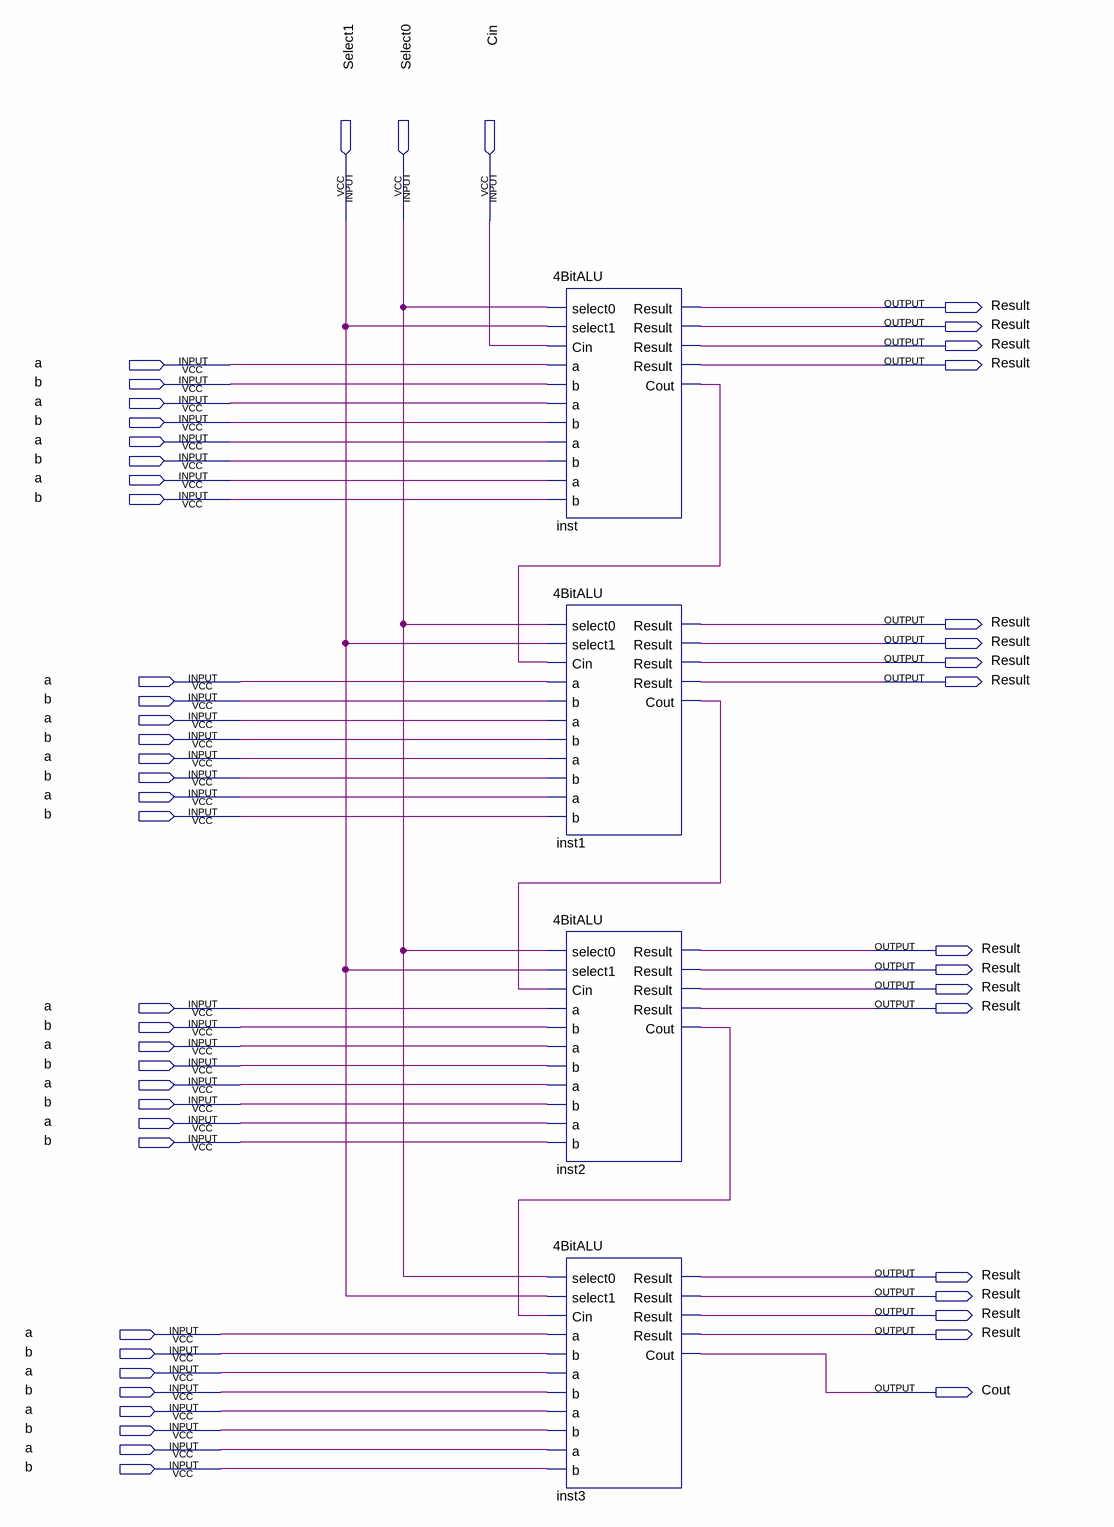
[diagram p0: schematic sheet]
// Quartus schematic 16BitALU.bdf as structural Verilog: 4 symbols, 52 pins
module \16BitALU  (
  input  Select1,
  input  Select0,
  input  Cin,
  input  a,
  input  b,
  output Result,
  output Cout
);

  wire inst1_cout, inst2_cout, inst_cout;

  \4BitALU  inst (
    .select0(Select0), .select1(Select1), .Cin(Cin), .a({4{a}}), .b({4{b}}), .Result({4{Result}}),
    .Cout(inst_cout));
  \4BitALU  inst1 (
    .select0(Select0), .select1(Select1), .Cin(inst_cout), .a({4{a}}), .b({4{b}}), .Result({4{Result}}),
    .Cout(inst1_cout));
  \4BitALU  inst2 (
    .select0(Select0), .select1(Select1), .Cin(inst1_cout), .a({4{a}}), .b({4{b}}), .Result({4{Result}}),
    .Cout(inst2_cout));
  \4BitALU  inst3 (
    .select0(Select0), .select1(Select1), .Cin(inst2_cout), .a({4{a}}), .b({4{b}}), .Result({4{Result}}),
    .Cout(Cout));
endmodule
